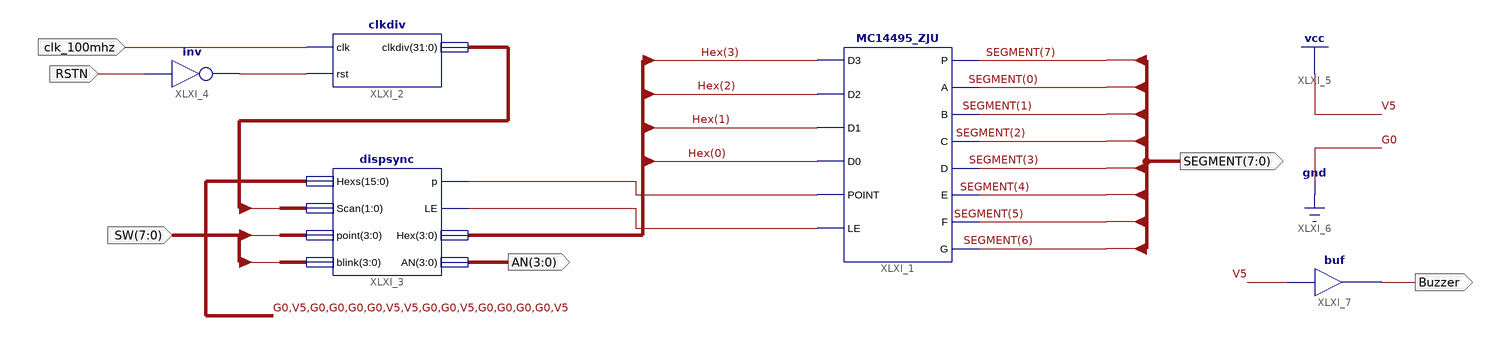
[diagram p0: schematic sheet 1]
// Xilinx ISE schematic Hex427Seg_sch.sch (kintex7) as structural Verilog: 5 symbols, 6 ports
module Hex427Seg_sch (
  input  RSTN,
  input  clk_100mhz,
  input  [7:0] SW,
  output [7:0] SEGMENT,
  output [3:0] AN,
  output Buzzer
);

  wire XLXN_3, XLXN_17, XLXN_18;
  wire [3:0] Hex;
  wire [31:0] clkdiv;

  MC14495_ZJU XLXI_1 (
    .D3(Hex[3]), .D2(Hex[2]), .D1(Hex[1]), .D0(Hex[0]), .POINT(XLXN_17), .LE(XLXN_18), .P(SEGMENT[7]),
    .A(SEGMENT[0]), .B(SEGMENT[1]), .C(SEGMENT[2]), .D(SEGMENT[3]), .E(SEGMENT[4]), .F(SEGMENT[5]),
    .G(SEGMENT[6]));
  clkdiv XLXI_2 (.clk(clk_100mhz), .rst(XLXN_3), .clkdiv(clkdiv));
  dispsync XLXI_3 (
    .Hexs(16'b0100001100100001), .Scan(clkdiv[8:7]), .point(SW[3:0]), .blink(SW[7:4]), .p(XLXN_17),
    .LE(XLXN_18), .Hex(Hex), .AN(AN));
  not XLXI_4 (XLXN_3, RSTN);
  buf XLXI_7 (Buzzer, 1'b1);
endmodule
